# Altium schematic sheet GR_Screen.SchDoc
size A4
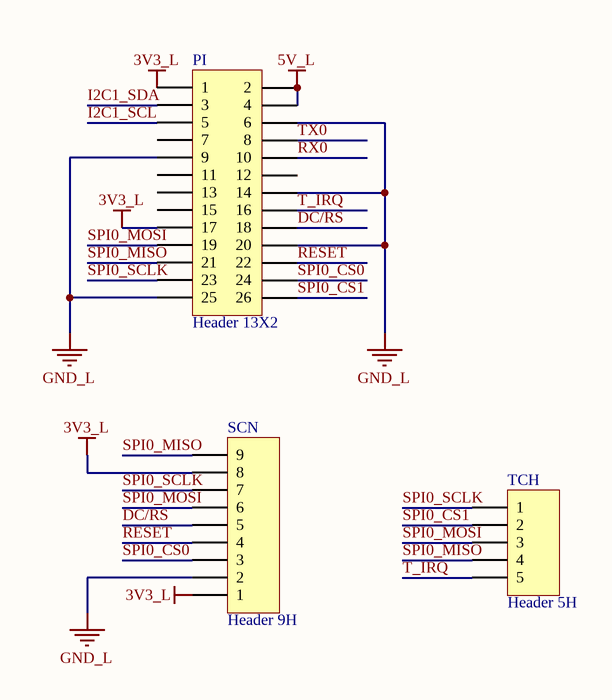
[diagram p0: GR_Screen.SchDoc]

## Parts
PI  Header 13X2  [HDR2X13]
SCN  Header 9H  [MOLEX SPOX 9H]
TCH  Header 5H  [MOLEX SPOX 5H]

## Nets
3V3_L: PI.1 PI.17 SCN.1 SCN.8
5V_L: PI.2 PI.4
GND_L: PI.6 PI.9 PI.14 PI.20 PI.25 SCN.2
DC/RS: PI.18 SCN.5
I2C1_SCL: PI.5
I2C1_SDA: PI.3
RESET: PI.22 SCN.4
RX0: PI.10
SPI0_CS0: PI.24 SCN.3
SPI0_CS1: PI.26 TCH.2
SPI0_MISO: PI.21 SCN.9 TCH.4
SPI0_MOSI: PI.19 SCN.6 TCH.3
SPI0_SCLK: PI.23 SCN.7 TCH.1
T_IRQ: PI.16 TCH.5
TX0: PI.8

Not connected (* = marked no-connect by the designer): PI 7 11 12 13 15

## Library data of the parts
PI = Header 13X2: Header, 13-Pin, Dual row; LatestRevisionDate: 17-Jul-2002; LatestRevisionNote: Re-released for DXP Platform.; Publisher: Altium Limited
SCN = Header 9H: Header, 9-Pin, Right Angle; LatestRevisionDate: 17-Jul-2002; LatestRevisionNote: Re-released for DXP Platform.; Publisher: Altium Limited
TCH = Header 5H: Header, 5-Pin, Right Angle; LatestRevisionDate: 17-Jul-2002; LatestRevisionNote: Re-released for DXP Platform.; Publisher: Altium Limited